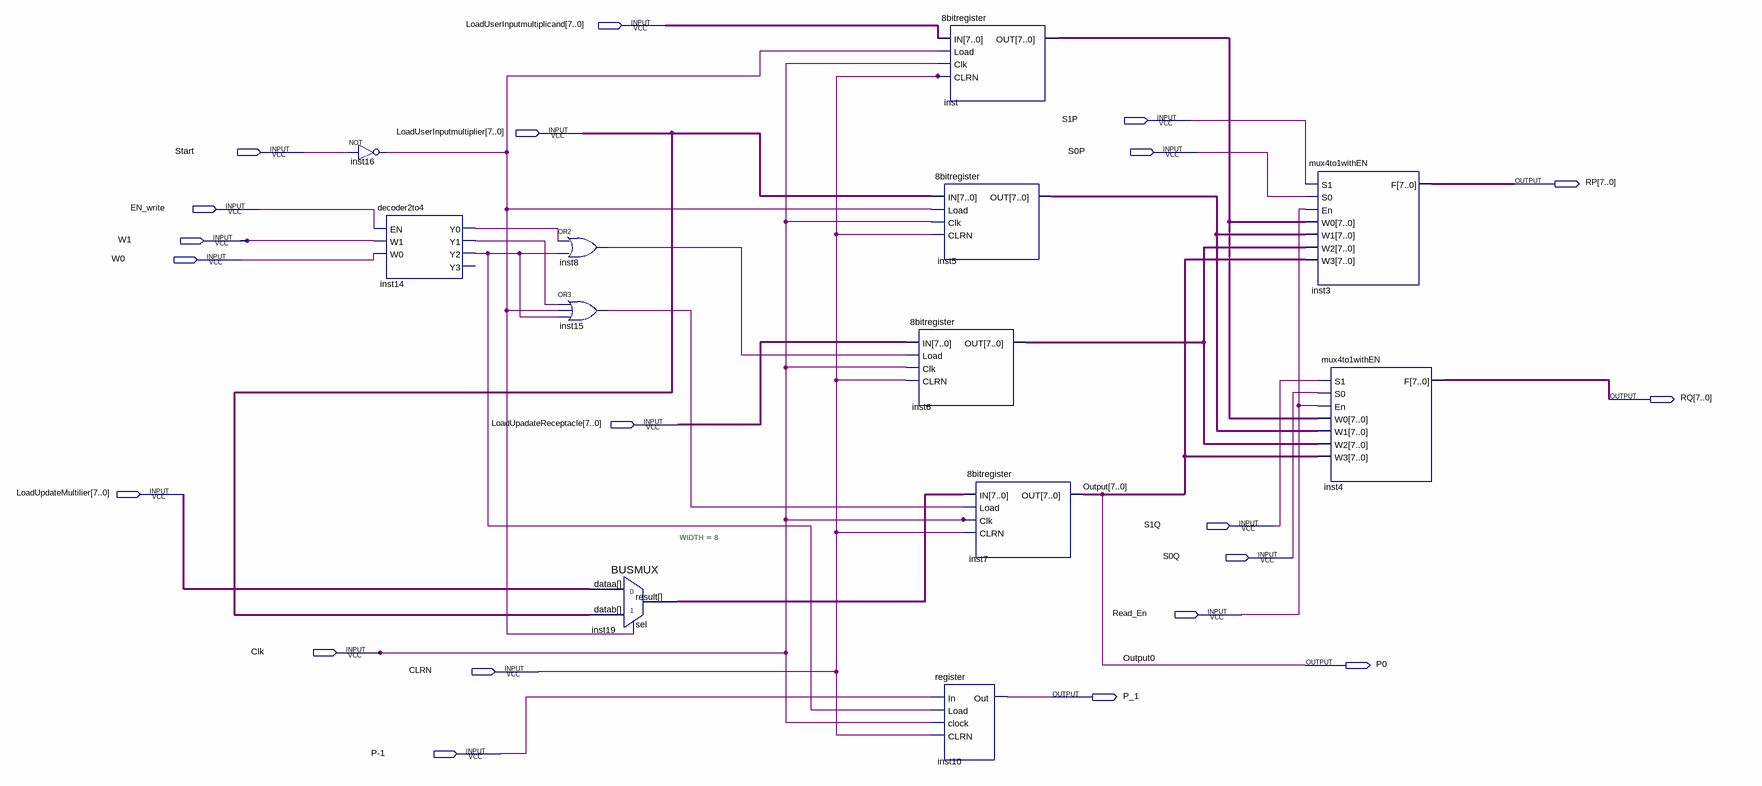
[diagram p0: schematic sheet]
// Quartus schematic registerfile.bdf as structural Verilog: 12 symbols, 20 pins
module registerfile (
  input  [7:0] LoadUserInputmultiplicand,
  input  S1P,
  input  [7:0] LoadUserInputmultiplier,
  input  Start,
  input  S0P,
  input  EN_write,
  input  W1,
  input  W0,
  input  [7:0] LoadUpadateReceptacle,
  input  [7:0] LoadUpdateMultilier,
  input  S1Q,
  input  S0Q,
  input  Read_En,
  input  Clk,
  input  CLRN,
  input  \P-1 ,
  output [7:0] RP,
  output [7:0] RQ,
  output P0,
  output P_1
);

  wire inst8_out, inst14_y0, inst14_y1, inst14_y2, inst15_out, inst16_out;
  wire [7:0] inst5_out, inst6_out, inst19_result, inst_out;
  wire [7:1] Output;

  not inst16 (inst16_out, Start);
  decoder2to4 inst14 (.EN(EN_write), .W1(W1), .W0(W0), .Y0(inst14_y0), .Y1(inst14_y1), .Y2(inst14_y2));  // open: Y3
  or inst8 (inst8_out, inst14_y0, inst14_y2);
  or inst15 (inst15_out, inst14_y1, inst16_out, inst14_y2);
  BUSMUX #(.WIDTH(8)) inst19 (
    .datab(LoadUserInputmultiplier), .sel(inst16_out), .dataa(LoadUpdateMultilier), .result(inst19_result));
  \8bitregister  inst6 (.IN(LoadUpadateReceptacle), .Load(inst8_out), .Clk(Clk), .CLRN(CLRN), .OUT(inst6_out));
  \8bitregister  inst (.IN(LoadUserInputmultiplicand), .Load(inst16_out), .Clk(Clk), .CLRN(CLRN), .OUT(inst_out));
  \8bitregister  inst5 (.IN(LoadUserInputmultiplier), .Load(inst16_out), .Clk(Clk), .CLRN(CLRN), .OUT(inst5_out));
  register inst10 (.In(\P-1 ), .Load(inst14_y2), .clock(Clk), .CLRN(CLRN), .Out(P_1));
  \8bitregister  inst7 (.IN(inst19_result), .Load(inst15_out), .Clk(Clk), .CLRN(CLRN), .OUT({Output, P0}));
  mux4to1withEN inst3 (
    .S1(S1P), .S0(S0P), .En(Read_En), .W0(inst_out), .W1(inst5_out), .W2(inst6_out), .W3({Output, P0}), .F(RP));
  mux4to1withEN inst4 (
    .S1(S1Q), .S0(S0Q), .En(Read_En), .W0(inst_out), .W1(inst5_out), .W2(inst6_out), .W3({Output, P0}), .F(RQ));

  // Other names for the same wires on the sheet: Output[0] = P0; Output0 = P0
endmodule
